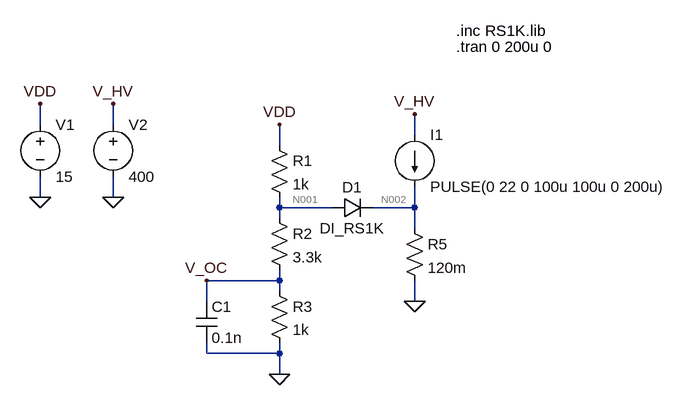
[diagram p0: schematic desaturation.asc]
desaturation.asc, the LTspice schematic file:
Version 4
SHEET 1 1256 868
WIRE -1296 160 -1296 128
WIRE -1184 160 -1184 128
WIRE -720 176 -720 144
WIRE -928 192 -928 160
WIRE -1296 272 -1296 240
WIRE -1184 272 -1184 240
WIRE -928 288 -928 272
WIRE -848 288 -928 288
WIRE -720 288 -720 256
WIRE -720 288 -784 288
WIRE -928 304 -928 288
WIRE -720 320 -720 288
WIRE -928 400 -928 384
WIRE -928 400 -1040 400
WIRE -928 416 -928 400
WIRE -1040 432 -1040 400
WIRE -720 432 -720 400
WIRE -1040 512 -1040 496
WIRE -928 512 -928 496
WIRE -928 512 -1040 512
WIRE -928 544 -928 512
FLAG -1296 128 VDD
FLAG -1040 400 V_OC
FLAG -928 544 0
FLAG -1296 272 0
FLAG -928 160 VDD
FLAG -720 432 0
FLAG -1184 128 V_HV
FLAG -1184 272 0
FLAG -720 144 V_HV
SYMBOL diode -848 304 R270
WINDOW 0 32 32 VTop 2
WINDOW 3 0 32 VBottom 2
SYMATTR InstName D1
SYMATTR Value DI_RS1K
SYMBOL res -944 176 R0
SYMATTR InstName R1
SYMATTR Value 1k
SYMBOL res -944 288 R0
SYMATTR InstName R2
SYMATTR Value 3.3k
SYMBOL res -944 400 R0
SYMATTR InstName R3
SYMATTR Value 1k
SYMBOL voltage -1296 144 R0
WINDOW 123 0 0 Left 0
WINDOW 39 0 0 Left 0
SYMATTR InstName V1
SYMATTR Value 15
SYMBOL cap -1056 432 R0
SYMATTR InstName C1
SYMATTR Value 0.1n
SYMBOL current -720 176 R0
WINDOW 123 0 0 Left 0
WINDOW 39 0 0 Left 0
SYMATTR InstName I1
SYMATTR Value PULSE(0 22 0 100u 100u 0 200u)
SYMBOL res -736 304 R0
SYMATTR InstName R5
SYMATTR Value 120m
SYMBOL voltage -1184 144 R0
WINDOW 123 0 0 Left 0
WINDOW 39 0 0 Left 0
SYMATTR InstName V2
SYMATTR Value 400
TEXT -656 40 Left 2 !.tran 0 200u 0
TEXT -656 16 Left 2 !.inc RS1K.lib

The netlist it stands for:
* desaturation.asc
D1 N001 N002 DI_RS1K
R1 VDD N001 1k
R2 N001 V_OC 3.3k
R3 V_OC 0 1k
V1 VDD 0 15
C1 V_OC 0 0.1n
I1 V_HV N002 PULSE(0 22 0 100u 100u 0 200u)
R5 N002 0 120m
V2 V_HV 0 400
.model D D
.lib standard.dio
.tran 0 200u 0
.inc RS1K.lib
.backanno
.end

* Results of the author's LTspice run, read from the files saved beside the schematic
* Operating Point, zero values left out:
*   V(n001) = 619.7 mV
*   V(n002) = 1.708 mV
*   V(vdd) = 15 V
*   V(v_oc) = 144.1 mV
*   V(v_hv) = 400 V
*   I(D1) = 14.24 mA
*   I(R5) = 14.24 mA
*   I(R3) = 144.1 µA
*   I(R2) = 144.1 µA
*   I(R1) = 14.38 mA
*   I(V1) = -14.38 mA
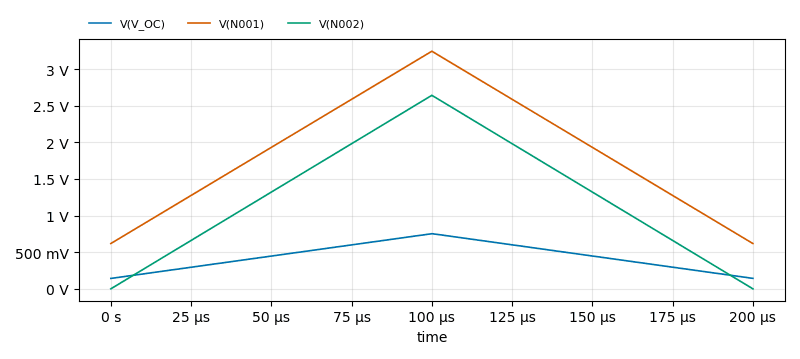
[diagram p1: Transient Analysis of desaturation.asc, plotted from the saved traces]
* Transient Analysis, 1 run:
*   V(V_OC): min 144.1 mV, max 753.7 mV, average 449.1 mV, rms 531.3 mV, last 144.6 mV
*   V(N001): min 619.6 mV, max 3.243 V, average 1.931 V, rms 2.285 V, last 619.6 mV
*   V(N002): min 1.708 mV, max 2.641 V, average 1.322 V, rms 1.804 V, last 1.708 mV